# EAGLE design liot_esp8266_env (EAGLE 7.4.0)
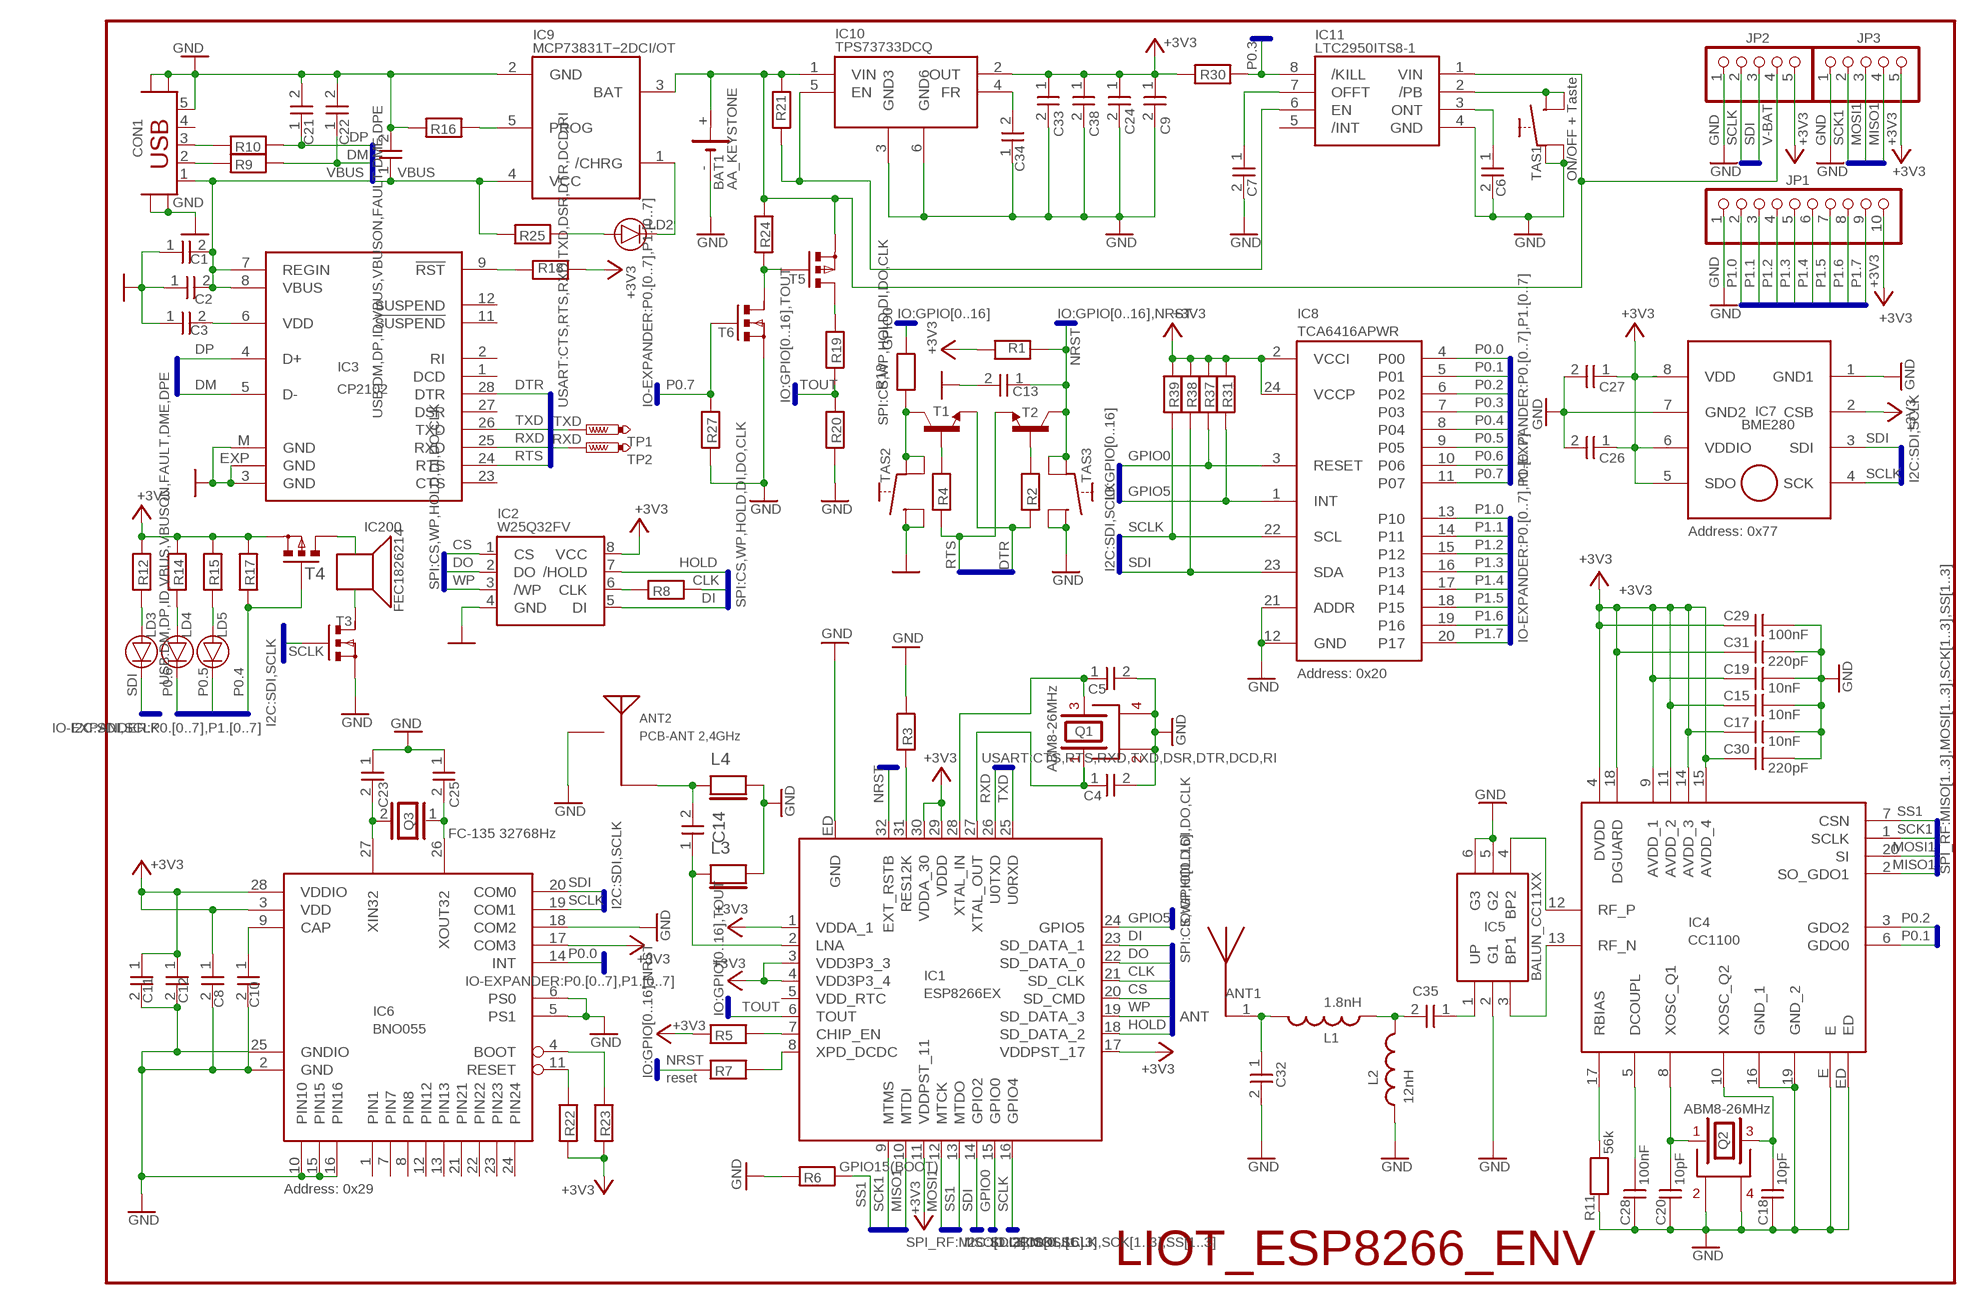
[diagram p0: schematic, sheet 1]

## Parts
ANT1  ANT_868MHZ  [ANT_868MHZ]
ANT2  PCB-ANT 2,4GHz  2.4GHZ_PCB  [2.4GHZ_PCB]
BAT1  AA_KEYSTONE  [AA_KEYSTONE]
C1  1U-16VX7R_0805  [C0805]
C2  1U-16VX7R_0805  [C0805]
C3  1U-16VX7R_0805  [C0805]
C4  10P-50VCOG_0603  [C0603]
C5  10P-50VCOG_0603  [C0603]
C6  100N-50VX7R_0603  [C0603]
C7  330N-16VX7R_0603  [C0603]
C8  100N-50VX7R_0603  [C0603]
C9  XX-XX-X7R_1210  [C1210]
C10  100N-50VX7R_0603  [C0603]
C11  6N8-50VX7R_0603  [C0603]
C12  100N-50VX7R_0603  [C0603]
C13  470P-50VX7R_0603  [C0603]
C14  5.6pF  CC0402  [C0402]
C15  10nF  CAPNP-2,5  [C0603]
C16  XX-XX-X7R_0805  [C0805]
C17  10nF  CAPNP-2,5  [C0603]
C18  10pF  CAPNP-2,5  [C0603]
C19  10nF  CAPNP-2,5  [C0603]
C20  10pF  CAPNP-2,5  [C0603]
C21  47P-50VCOG_0603  [C0603]
C22  47P-50VCOG_0603  [C0603]
C23  22P-50VNP0_0603  [C0603]
C24  100N-50VX7R_0603  [C0603]
C25  22P-50VNP0_0603  [C0603]
C26  100N-50VX7R_0603  [C0603]
C27  100N-50VX7R_0603  [C0603]
C28  100nF  CAPNP-2,5  [C0603]
C29  100nF  CAPNP-2,5  [C0603]
C30  220pF  CAPNP-2,5  [C0603]
C31  220pF  CAPNP-2,5  [C0603]
C32  10P-50VCOG_0603  [C0603]
C33  XX-XX-NB-X7R_1210  [C1210]
C34  XX-XX-X7R_0805  [C0805]
C35  100P-50VCOG_0603  [C0603]
C38  XX-XX-NB-X7R_1210  [C1210]
CON1  MICRO-USB-A/B  [MICRO_USB_A/B]
IC1  ESP8266EX  [ESP8266EX]
IC2  W25Q32FV  [SOIC-8_208MIL]
IC3  CP2102  [MLP28]
IC4  CC1100  [QLP20E-1+]
IC5  BALUN_CC11XX  [BALUN_CC11XX]
IC6  BNO055  [BNO055]
IC7  BME280  [BME280]
IC8  TCA6416APWR  [TSSOP24]
IC9  MCP73831T−2DCI/OT  LTC4054  [TSOT-23]
IC10  TPS73733DCQ  TPS73733DQC  [SOT223-6]
IC11  LTC2950ITS8-1  LTC2950  [TS8]
IC200  FEC1826214  BEEPER5X5  [BEEPER5X5]
JP1  PINHD-1X10  [1X10]
JP2  PINHD-1X5  [1X05]
JP3  PINHD-1X5  [1X05]
L1  1.8nH  L0603  [0603]
L2  12nH  L0603  [0603]
L3  NC  LL0402  [L0402]
L4  NC  LL0402  [L0402]
LD2  XXX_0603_H04  [LD0603_H04]
LD3  XXX_0603_H04  [LD0603_H04]
LD4  XXX_0603_H04  [LD0603_H04]
LD5  XXX_0603_H04  [LD0603_H04]
MA_BS1  MA_BS_L  [MARK_L]
MA_BS2  MA_BS_L  [MARK_L]
MA_LS1  MA_LS_L  [MARK_L]
MA_LS2  MA_LS_L  [MARK_L]
Q1  ABM8-26MHz  ABM8G  [ABM8G]
Q2  ABM8-26MHz  ABM8G  [ABM8G]
Q3  FC-135 32768Hz  FC-135  [FC-135]
R1  12K-1%_0603  [R0603]
R2  12K-1%_0603  [R0603]
R3  12K-1%_0603  [R0603]
R4  12K-1%_0603  [R0603]
R5  12K-1%_0603  [R0603]
R6  12K-1%_0603  [R0603]
R7  0R-1%_0603  [R0603]
R8  200R-1%_0603  [R0603]
R9  22R-1%_0603  [R0603]
R10  22R-1%_0603  [R0603]
R11  56k  RESEU-S2,5  [R0603]
R12  1K-1%_0603  [R0603]
R13  220R-1%_0603  [R0603]
R14  1K-1%_0603  [R0603]
R15  1K-1%_0603  [R0603]
R16  2K-1%_0603  [R0603]
R17  1K-1%_0603  [R0603]
R18  10K-1%_0603  [R0603]
R19  390K-1%_0603  [R0603]
R20  100K-1%_0603  [R0603]
R21  100K-1%_0603  [R0603]
R22  10K-1%_0603  [R0603]
R23  10K-1%_0603  [R0603]
R24  10K-1%_0603  [R0603]
R25  680R-1%_0603  [R0603]
R27  10K-1%_0603  [R0603]
R30  100K-1%_0603  [R0603]
R31  10K-1%_0603  [R0603]
R37  10K-1%_0603  [R0603]
R38  10K-1%_0603  [R0603]
R39  10K-1%_0603  [R0603]
T1  BC817-NPN-SOT23-BEC  [SOT23-BEC]
T2  BC817-NPN-SOT23-BEC  [SOT23-BEC]
T3  IRLML2402  [SOT23S23]
T4  IRLML6402  [SOT23S23]
T5  IRLML6402  [SOT23S23]
T6  IRLML2402  [SOT23S23]
TAS1  434333045822  [TAWU1_S_H18]
TAS2  434333045822  [TAWU1_S_H18]
TAS3  434333045822  [TAWU1_S_H18]
TP1  PTR1B1,27  [B1,27]
TP2  PTR1B1,27  [B1,27]

## Nets
+3V3: C8.1(C) C9.1(C) C11.1(C) C12.1(C) C15.1 C17.1 C19.1 C24.1(C) C26.1(C) C27.1(C) C29.1 C30.1 C31.1 C33.1(C) C38.1(C) IC1.1(VDDA_1) IC1.3(VDD3P3_3) IC1.4(VDD3P3_4) IC1.11(VDDPST_11) IC1.17(VDDPST_17) IC1.29(VDDD) IC1.30(VDDA_30) IC2.8(VCC) IC4.4(DVDD) IC4.9(AVDD_1) IC4.11(AVDD_2) IC4.14(AVDD_3) IC4.15(AVDD_4) IC4.18(DGUARD) IC6.3(VDD) IC6.17(COM3) IC6.28(VDDIO) IC7.2(CSB) IC7.5(SDO) IC7.6(VDDIO) IC7.8(VDD) IC8.2(VCCI) IC8.24(VCCP) IC10.2(OUT) JP1.10 JP2.5 JP3.5 R1.2(R) R5.1(R) R12.2(R) R14.2(R) R15.2(R) R17.2(R) R18.1(R) R22.1(R) R23.1(R) R30.2(R) R31.2(R) R37.2(R) R38.2(R) R39.2(R) T4.2(S)
/PB: IC11.2(/PB) TAS1.2(ON) TAS1.4(ON1)
CLK: IC1.21(SD_CLK) R8.2(R)
CS: IC1.20(SD_CMD) IC2.1(CS)
DI: IC1.23(SD_DATA_1) IC2.5(DI)
DM: C22.1(C) IC3.5(D-) R9.1(R)
DME: CON1.2(D-) R9.2(R)
DO: IC1.22(SD_DATA_0) IC2.2(DO)
DP: C21.1(C) IC3.4(D+) R10.1(R)
DPE: CON1.3(D+) R10.2(R)
DTR: IC3.28(DTR) R2.1(R) T1.E
GND: ANT2.GND BAT1.- C1.1(C) C2.1(C) C3.1(C) C4.2(C) C5.2(C) C6.2(C) C7.2(C) C8.2(C) C9.2(C) C10.2(C) C11.2(C) C12.2(C) C13.2(C) C15.2 C16.2(C) C17.2 C18.1 C19.2 C20.1 C21.2(C) C22.2(C) C23.1(C) C24.2(C) C25.1(C) C26.2(C) C27.2(C) C28.1 C29.2 C30.2 C31.2 C32.2(C) C33.2(C) C34.1(C) C38.2(C) CON1.5(GND) CON1.S1(GND) CON1.S2(GND) CON1.S3(GND) CON1.S4(GND) CON1.S5(GND) CON1.S6(GND) CON1.S7(GND) CON1.S8(GND) CON1.S9(GND) CON1.S10(GND) CON1.S11(GND) CON1.S12(GND) IC1.ED(GND) IC2.4(GND) IC3.3(GND) IC3.EXP(GND) IC3.M(GND) IC4.16(GND_1) IC4.19(GND_2) IC4.E IC4.ED IC5.2(G1) IC5.5(G2) IC5.6(G3) IC6.2(GND) IC6.5(PS1) IC6.6(PS0) IC6.10(PIN10) IC6.15(PIN15) IC6.16(PIN16) IC6.18(COM2) IC6.25(GNDIO) IC7.1(GND1) IC7.7(GND2) IC8.12(GND) IC8.21(ADDR) IC9.2(GND) IC10.3(GND3) IC10.6(GND6) IC11.4(GND) JP1.1 JP2.1 JP3.1 L2.1 L3.2(L) L4.2(L) Q1.2 Q1.4 Q2.2 Q2.4 R3.2(R) R6.1(R) R11.1 R16.1(R) R20.2(R) R27.1(R) T3.2(S) T6.2(S) TAS1.1(COMM) TAS1.3(COMM1) TAS2.2(ON) TAS2.4(ON1) TAS3.2(ON) TAS3.4(ON1)
GPIO0: IC1.15(GPIO0) IC8.3(RESET) R13.2(R) R37.1(R)
GPIO5: IC1.24(GPIO5) IC8.1(INT) R31.1(R)
HOLD: IC1.18(SD_DATA_2) IC2.7(/HOLD)
IC12: IC200.- T3.3(D)
MISO1: IC1.10(MTDI) IC4.2(SO_GDO1) JP3.4
MOSI1: IC1.12(MTCK) IC4.20(SI) JP3.3
N$1: C4.1(C) IC1.27(XTAL_OUT) Q1.1
N$2: R2.2(R) T2.B
N$3: C3.2(C) IC3.6(VDD)
N$4: IC1.7(CHIP_EN) R5.2(R)
N$5: R4.2(R) T1.B
N$6: IC1.31(RES12K) R3.1(R)
N$7: IC1.8(XPD_DCDC) R7.1(R)
N$8: IC2.6(CLK) R8.1(R)
N$10: C14.1(C) IC1.2(LNA) L3.1(L)
N$11: C18.2 IC4.10(XOSC_Q2) Q2.3
N$12: C20.2 IC4.8(XOSC_Q1) Q2.1
N$13: IC4.17(RBIAS) R11.2
N$14: C28.2 IC4.5(DCOUPL)
N$15: C5.1(C) IC1.28(XTAL_IN) Q1.3
N$16: IC9.5(PROG) R16.2(R)
N$17: IC9.1(/CHRG) LD2.2(K)
N$18: IC4.13(RF_N) IC5.3(BP1)
N$19: IC4.12(RF_P) IC5.4(BP2)
N$20: ANT1.1(ANT) C32.1(C) L1.2
N$21: LD2.1(A) R25.1(R)
N$22: C35.2(C) L1.1 L2.2
N$23: C35.1(C) IC5.1(UP)
N$24: ANT2.ANT C14.2(C) L4.1(L)
N$25: IC6.11(RESET) R22.2(R)
N$26: IC6.4(BOOT) R23.2(R)
N$27: C10.1(C) IC6.9(CAP)
N$28: C23.2(C) IC6.27(XIN32) Q3.2
N$29: IC10.5(EN) IC11.6(EN) R21.1(R)
N$30: C25.2(C) IC6.26(XOUT32) Q3.1
N$32: R13.1(R) T1.C TAS2.1(COMM) TAS2.3(COMM1)
N$33: C34.2(C) IC10.4(FR)
N$34: IC200.+ T4.3(D)
N$35: LD3.1(A) R12.1(R)
N$36: LD4.1(A) R14.1(R)
N$37: IC3.9(!RST) R18.2(R)
N$38: LD5.1(A) R15.1(R)
N$39: R19.2(R) T5.3(D)
N$40: R24.1(R) T5.1(G) T6.3(D)
N$58: C7.1(C) IC11.7(OFFT)
N$59: C6.1(C) IC11.3(ONT)
NRST: C13.1(C) IC1.32(EXT_RSTB) R1.1(R) R7.2(R) T2.C TAS3.1(COMM) TAS3.3(COMM1)
P0.0: IC6.14(INT) IC8.4(P00)
P0.1: IC4.6(GDO0) IC8.5(P01)
P0.2: IC4.3(GDO2) IC8.6(P02)
P0.3: IC8.7(P03) IC11.8(/KILL) R30.1(R)
P0.4: IC8.8(P04) R17.1(R) T4.1(G)
P0.5: IC8.9(P05) LD5.2(K)
P0.6: IC8.10(P06) LD4.2(K)
P0.7: IC8.11(P07) R27.2(R) T6.1(G)
P1.0: IC8.13(P10) JP1.2
P1.1: IC8.14(P11) JP1.3
P1.2: IC8.15(P12) JP1.4
P1.3: IC8.16(P13) JP1.5
P1.4: IC8.17(P14) JP1.6
P1.5: IC8.18(P15) JP1.7
P1.6: IC8.19(P16) JP1.8
P1.7: IC8.20(P17) JP1.9
RTS: IC3.24(RTS) R4.1(R) T2.E
RXD: IC1.26(U0TXD) IC3.25(RXD) TP2.PP(TP)
SCK1: IC1.9(MTMS) IC4.1(SCLK) JP3.2
SCLK: IC1.16(GPIO4) IC6.19(COM1) IC7.4(SCK) IC8.22(SCL) JP2.2 R39.1(R) T3.1(G)
SDI: IC1.14(GPIO2) IC6.20(COM0) IC7.3(SDI) IC8.23(SDA) JP2.3 LD3.2(K) R38.1(R)
SS1: IC1.13(MTDO) IC4.7(CSN) R6.2(R)
TOUT: IC1.6(TOUT) R19.1(R) R20.1(R)
TXD: IC1.25(U0RXD) IC3.26(TXD) TP1.PP(TP)
V-BAT: BAT1.+ IC9.3(BAT) IC10.1(VIN) IC11.1(VIN) JP2.4 R21.2(R) R24.2(R) T5.2(S)
VBUS: C1.2(C) C2.2(C) C16.1(C) CON1.1(VBUS) IC3.7(REGIN) IC3.8(VBUS) IC9.4(VCC) R25.2(R)
WP: IC1.19(SD_DATA_3) IC2.3(/WP)
Unconnected: CON1.4(ID) IC1.5(VDD_RTC) IC3.1(DCD) IC3.2(RI) IC3.11(!SUSPEND) IC3.12(SUSPEND) IC3.23(CTS) IC3.27(DSR) IC6.1(PIN1) IC6.7(PIN7) IC6.8(PIN8) IC6.12(PIN12) IC6.13(PIN13) IC6.21(PIN21) IC6.22(PIN22) IC6.23(PIN23) IC6.24(PIN24) IC11.5(/INT) IC200.NC MA_BS1.1(MARK) MA_BS2.1(MARK) MA_LS1.1(MARK) MA_LS2.1(MARK)

## Buses
USB:DM,DP,ID,VBUS,VBUSON,FAULT,DME,DPE
USART:CTS,RTS,RXD,TXD,DSR,DTR,DCD,RI
SPI:CS,WP,HOLD,DI,DO,CLK
I2C:SDI,SCLK
IO-EXPANDER:P0.[0..7],P1.[0..7]
IO:GPIO[0..16]
IO:GPIO[0..16],NRST
SPI_RF:MISO[1..3],MOSI[1..3],SCK[1..3],SS[1..3]
IO:GPIO[0..16],TOUT

## Notes on the sheet
- ON/OFF + Taste
- Address: 0x77
- Address: 0x20
- reset
- GPIO15(BOOT)
- Address: 0x29
- LIOT_ESP8266_ENV

## Library data of the parts
ANT1 = Liers_RF:ANT_868MHZ
ANT2 = Liers_RF:2.4GHZ_PCB
BAT1 = RADIO:AA_KEYSTONE
C1-C3 C6-C13 C16 C24 C26 C27 C33 C34 C38 = kke:*X7R?: Kerko XXXX7R
C4 C5 C21 C22 C32 C35 = kke:*COG?: KEMET Kerko Keramik COG -55.+125C
C14 = RADIO:C
C15 C17-C20 C28-C31 = DISCRETE:CAPNP-2,5
C23 C25 = kke:*NP0?: NICHT-EINSETZEN-KEMET Kerko Keramik NP0 -55.+125C
CON1 = Liers_RF:MICRO-USB-A/B
IC1 = LIOT:ESP8266EX
IC2 = Liers_WiFi:W25Q32FV
IC3 = silabs:CP210*: Single-Chip USB to UART Bridge Source: www.silabs.com .. CP2101.pdf / cp2102.pdf
IC4 = RADIO:CC1100
IC5 = CC430:BALUN_CC11XX
IC6 = Liers_RF:BNO055
IC7 = Liers_RF:BME280
IC8 = Liers_RF:TCA6416APWR
IC9 = RADIO:LTC4054
IC10 = Liers_RF:TPS73733DQC
IC11 = Liers_RF:LTC2950
IC200 = Liers_Extra:BEEPER5X5
JP1 = PINHEAD_old:PINHD-1X10
JP2 JP3 = PINHEAD_old:PINHD-1X5
L1 L2 = Liers_SMD:L0603
L3 L4 = RADIO:L
LD2-LD5 = Liers_WiFi:*?: DIVERSE LED 2mA / 20mA; ARTNR1: SHP-98903-000
MA_BS1 MA_BS2 = xko:MA_BS: Marke für SMD-Automat bauteileseitig; ARTNR1: XKO-99997-000
MA_LS1 MA_LS2 = xko:MA_LS: Marke für SMD-Automat lötseitig; ARTNR1: XKO-99997-000
Q1 Q2 = RADIO:ABM8G
Q3 = RADIO:FC-135
R1-R10 R12-R25 R27 R30 R31 R37-R39 = wdm:*-1%?: DIVERSE Widerstand Metallfilm 1%
R11 = DISCRETE:RESEU-S2,5
T1 T2 = transistor:*-NPN-: NPN Transistror
T3 T6 = LIERS_wireless:IRLML2402
T4 T5 = LIERS_wireless:IRLML6402
TAS1-TAS3 = liers:434333045822?: WUERTH SMD Taste seitliche Betätigung 434333045822 12V 50mA 100mR; ARTNR1: TAS-99953-000
TP1 TP2 = testpad:PTR1: TEST PIN

## Board
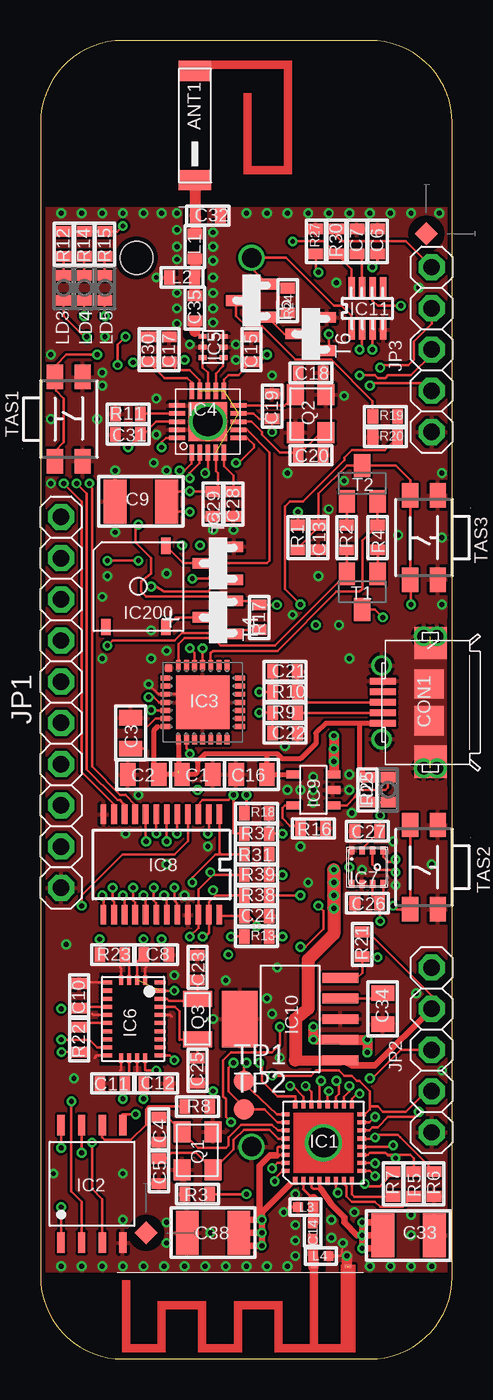
[diagram p1: board, top side]
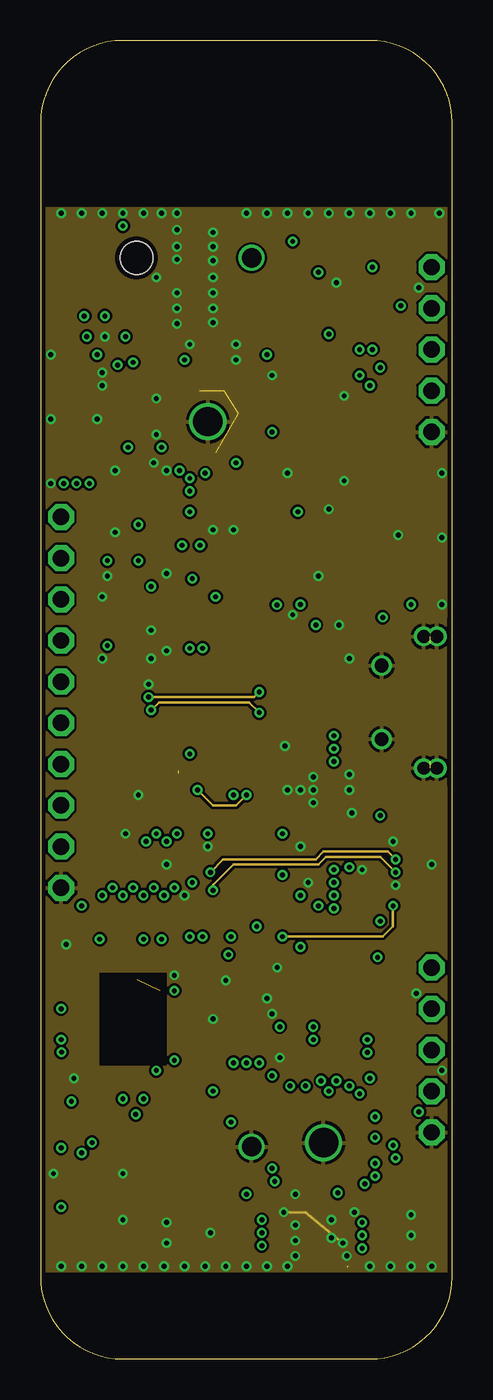
[diagram p2: board, inner layer Route2]
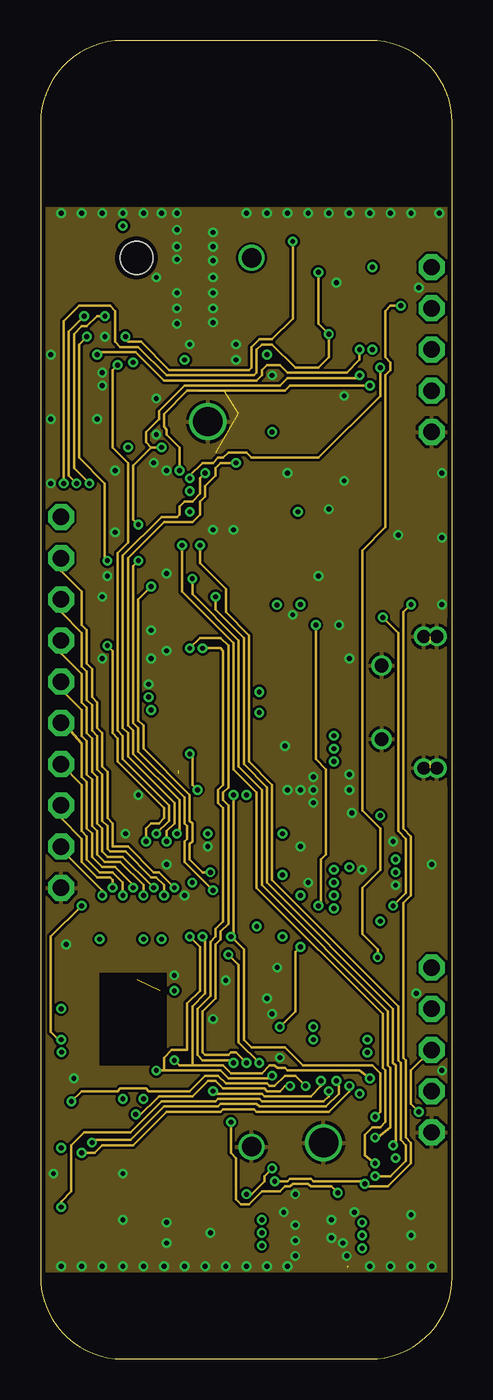
[diagram p3: board, inner layer Route15]
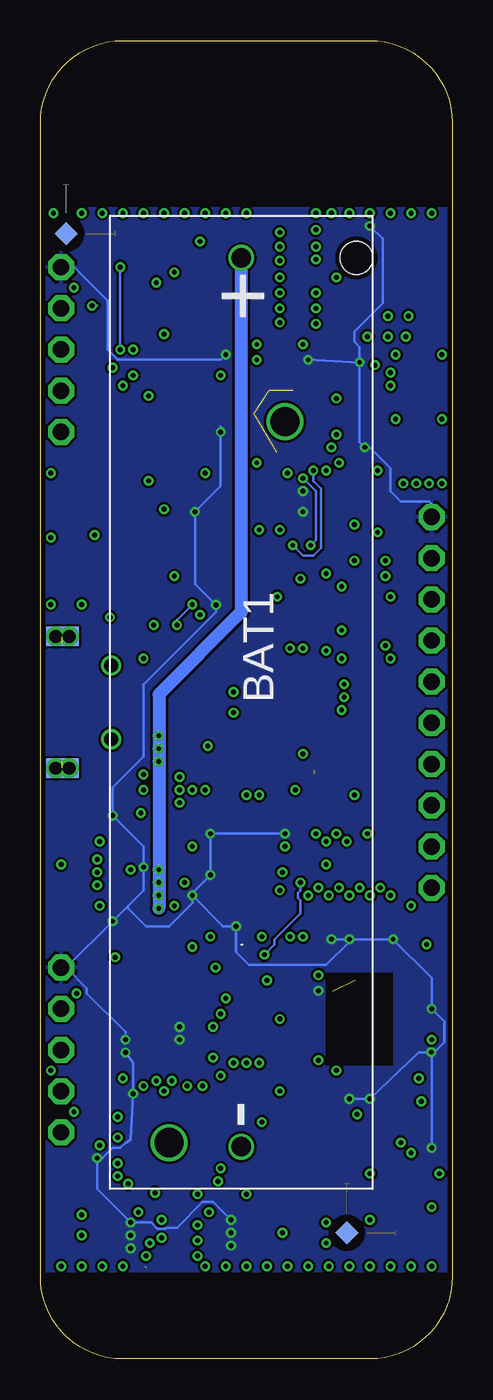
[diagram p4: board, bottom side, seen from below]

Size 25.4 x 81.28 mm. Coordinates in mm from the lower left corner, seen from the top.
Outline: 0,5.08 arc90 5.08,0 20.32,0 arc90 25.4,5.08 25.4,76.2 arc90 20.32,81.28 5.08,81.28 arc90 0,76.2 0,5.08
Copper layers (1+2*15+16): Top 0.035mm / dielectric 0.38mm / Route2 0.035mm / dielectric 0.71mm / Route15 0.035mm / dielectric 0.38mm / Bottom 0.035mm
Design rules "PCB-POOL Standard_ML4 *": minimum track width 0.15mm, minimum drill 0.3mm, track to track 0.15mm, track to pad 0.15mm, pad to pad 0.15mm, via to via 0.15mm, smd to smd 0.15mm, copper to edge 0.3mm, drill to drill 0.2mm, minimum pad ring 0.2mm, minimum via ring 0.15mm, stop-mask expansion 0.075mm, vias tented up to drill 0mil, thermal gap 0.2mm
tRestrict: 8 lines

### Footprints (pad centres in the part's own frame; a part is rotated, then mirrored left to right if it is on the bottom)
ANT_868MHZ = smd 2 x 1.25: 1 0,-3.37; 2 0,3.37
2.4GHZ_PCB = smd 0.406 x 0.203: ANT 3.05,-0.4; GND 0.95,-0.4
AA_KEYSTONE = drill 1.2: + 27.4,0; - -27.4,0 | hole 2: 27.4,-7.1
C0805 = smd 0.95 x 1.4: 1 -0.953,0; 2 0.953,0
C0603 = smd 0.65 x 0.9: 1 -0.769,0; 2 0.769,0
C1210 = smd 1.4 x 2.7: 1 -1.587,0; 2 1.587,0
C0402 = smd 0.6 x 0.6: 1 -0.476,0; 2 0.476,0
MICRO_USB_A/B = smd 1.6 x 0.4: 1 3.006,1.3; 2 3.006,0.65; 3 3.006,0; 4 3.006,-0.65; 5 3.006,-1.3 | drill 0.8 pad 1.2: S1 0.487,4.062; S2 -0.325,4.062; S8 -0.325,-4.062; S9 0.487,-4.062 | smd 2 x 1.2 bottom: S3 0.081,4.062; S10 0.081,-4.062 | smd 2 x 2: S4 0.081,3.656; S7 0.081,-3.656 | smd 1.8 x 1.8: S5 0.163,1.137; S6 0.163,-1.137 | drill 0.85 pad 1.2: S11 3.087,-2.275; S12 3.087,2.275
ESP8266EX = smd 0.5 x 0.25: 1 -2.35,1.75; 2 -2.35,1.25; 3 -2.35,0.75; 4 -2.35,0.25; 5 -2.35,-0.25; 6 -2.35,-0.75; 7 -2.35,-1.25; 8 -2.35,-1.75; 17 2.35,-1.75; 18 2.35,-1.25; 19 2.35,-0.75; 20 2.35,-0.25; 21 2.35,0.25; 22 2.35,0.75; 23 2.35,1.25; 24 2.35,1.75 | smd 0.25 x 0.5: 9 -1.75,-2.35; 10 -1.25,-2.35; 11 -0.75,-2.35; 12 -0.25,-2.35; 13 0.25,-2.35; 14 0.75,-2.35; 15 1.25,-2.35; 16 1.75,-2.35; 25 1.75,2.35; 26 1.25,2.35; 27 0.75,2.35; 28 0.25,2.35; 29 -0.25,2.35; 30 -0.75,2.35; 31 -1.25,2.35; 32 -1.75,2.35 | drill 1.8 pad 2.286: ED 0,0
SOIC-8_208MIL = smd 0.457 x 1.27: 1 -1.905,-3.619; 2 -0.635,-3.619; 3 0.635,-3.619; 4 1.905,-3.619; 5 1.905,3.619; 6 0.635,3.619; 7 -0.635,3.619; 8 -1.905,3.619
MLP28 = smd 0.6 x 0.3: 1 -2.3,1.5; 2 -2.3,1; 3 -2.3,0.5; 4 -2.3,0; 5 -2.3,-0.5; 6 -2.3,-1; 7 -2.3,-1.5; 15 2.3,-1.5; 16 2.3,-1; 17 2.3,-0.5; 18 2.3,0; 19 2.3,0.5; 20 2.3,1; 21 2.3,1.5 | smd 0.3 x 0.6: 8 -1.5,-2.3; 9 -1,-2.3; 10 -0.5,-2.3; 11 0,-2.3; 12 0.5,-2.3; 13 1,-2.3; 14 1.5,-2.3; 22 1.5,2.3; 23 1,2.3; 24 0.5,2.3; 25 0,2.3; 26 -0.5,2.3; 27 -1,2.3; 28 -1.5,2.3 | smd 3.3 x 3.3: EXP 0,0 | smd 0.435 x 0.435: M -2.103,2.103
QLP20E-1+ = smd 0.28 x 1: 1 -1,-1.9; 2 -0.5,-1.9; 3 0,-1.9; 4 0.5,-1.9; 5 1,-1.9; 11 1,1.9; 12 0.5,1.9; 13 0,1.9; 14 -0.5,1.9; 15 -1,1.9 | smd 1 x 0.28: 6 1.9,-1; 7 1.9,-0.5; 8 1.9,0; 9 1.9,0.5; 10 1.9,1; 16 -1.9,1; 17 -1.9,0.5; 18 -1.9,0; 19 -1.9,-0.5; 20 -1.9,-1 | smd 2.4 x 2.4: E 0,0 | drill 1.8 pad 2.286: ED 0,0
BALUN_CC11XX = smd 0.3 x 0.5: 1 0.65,0.651; 2 0,0.65; 3 -0.65,0.65; 4 -0.651,-0.651; 5 0,-0.652; 6 0.65,-0.651
BNO055 = smd 0.25 x 0.675: 1 -2.25,1.65; 6 -2.25,-1.65; 7 -1.75,-1.65; 8 -1.25,-1.65; 9 -0.75,-1.65; 10 -0.25,-1.65; 11 0.25,-1.65; 12 0.75,-1.65; 13 1.25,-1.65; 14 1.75,-1.65; 15 2.25,-1.65; 20 2.25,1.65; 21 1.75,1.65; 22 1.25,1.65; 23 0.75,1.65; 24 0.25,1.65; 25 -0.25,1.65; 26 -0.75,1.65; 27 -1.25,1.65; 28 -1.75,1.65 | smd 0.575 x 0.25: 2 -2.4,0.75; 3 -2.4,0.25; 4 -2.4,-0.25; 5 -2.4,-0.75; 16 2.4,-0.75; 17 2.4,-0.25; 18 2.4,0.25; 19 2.4,0.75
BME280 = smd 0.35 x 0.5: 1 0.975,-1.025; 2 0.325,-1.025; 3 -0.325,-1.025; 4 -0.975,-1.025; 5 -0.975,1.025; 6 -0.325,1.025; 7 0.325,1.025; 8 0.975,1.025
TSSOP24 = smd 0.35 x 1.2: 1 -3.575,-3.099; 2 -2.925,-3.099; 3 -2.275,-3.099; 4 -1.625,-3.099; 5 -0.975,-3.099; 6 -0.325,-3.099; 7 0.325,-3.099; 8 0.975,-3.099; 9 1.625,-3.099; 10 2.275,-3.099; 11 2.925,-3.099; 12 3.575,-3.099; 13 3.575,3.099; 14 2.925,3.099; 15 2.275,3.099; 16 1.625,3.099; 17 0.975,3.099; 18 0.325,3.099; 19 -0.325,3.099; 20 -0.975,3.099; 21 -1.625,3.099; 22 -2.275,3.099; 23 -2.925,3.099; 24 -3.575,3.099
TSOT-23 = smd 0.5 x 0.9: 1 -0.95,-1.216; 2 0,-1.216; 3 0.95,-1.216; 4 0.95,1.216; 5 -0.95,1.216
SOT223-6 = smd 0.6 x 2.2: 1 -2.54,-3.1; 2 -1.27,-3.1; 3 0,-3.1; 4 1.27,-3.1; 5 2.54,-3.1 | smd 3.5 x 2.2: 6 0,3.1
TS8 = smd 0.4 x 1.27: 1 -0.975,-1.3; 2 -0.325,-1.3; 3 0.325,-1.3; 4 0.975,-1.3; 5 0.975,1.3; 6 0.325,1.3; 7 -0.325,1.3; 8 -0.975,1.3
BEEPER5X5 = smd 1 x 0.6: + -2.5,-1.7; - 2.5,-1.7; NC -2.5,2
1X10 = drill 1.016 pad 1.6 octagon: 1 -11.43,0; 2 -8.89,0; 3 -6.35,0; 4 -3.81,0; 5 -1.27,0; 6 1.27,0; 7 3.81,0; 8 6.35,0; 9 8.89,0; 10 11.43,0
1X05 = drill 1.016 pad 1.6 octagon: 1 -5.08,0; 2 -2.54,0; 3 0,0; 4 2.54,0; 5 5.08,0
0603 = smd 0.65 x 0.9: 1 -0.769,0; 2 0.769,0
L0402 = smd 0.6 x 0.6: 1 -0.476,0; 2 0.476,0
LD0603_H04 = smd 0.65 x 0.9: 1 0.769,0; 2 -0.769,0
MARK_L = smd 1 x 1 rotated 45: 1 0,0
ABM8G = smd 1.3 x 1.05: 1 -1.15,-0.95; 2 1.2,-0.95; 3 1.2,0.95; 4 -1.15,0.95
FC-135 = smd 1 x 1.8: 1 -1.25,0; 2 1.25,0
R0603 = smd 0.65 x 0.9: 1 -0.769,0; 2 0.769,0
SOT23-BEC = smd 1 x 1.4: B -0.95,-1.1; C 0,1.1; E 0.95,-1.1
SOT23S23 = smd 1.1 x 0.65: 1 0.986,-1.018; 2 0.991,1.017; 3 -1.016,0
TAWU1_S_H18 = smd 1 x 1.5: 1 0.85,-2.6; 2 -0.85,-2.6; 3 0.85,2.6; 4 -0.85,2.6
B1,27 = smd 1.27 x 1.27: PP 0,0

### Placement (x,y rotation side)
ANT1  9.53,76.04 0 top
ANT2  19.92,5.32 180 top
BAT1  13.02,40.48 90 bottom
C1  9.68,36.04 180 top
C2  6.35,36.04 0 top
C3  5.56,38.58 270 top
C4  7.3,14.13 270 top
C5  7.3,11.59 270 top
C6  20.8,68.9 90 top
C7  19.53,68.9 90 top
C8  7.14,24.92 0 top
C9  6.19,52.86 180 top
C10  2.38,22.38 90 top
C11  4.45,16.99 180 top
C12  7.14,16.99 0 top
C13  17.14,50.64 270 top
C14  16.79,7.89 270 top
C15  13.02,62.23 90 top
C16  13.02,36.04 180 top
C17  7.94,62.23 90 top
C18  16.67,60.8 180 top
C19  14.29,58.74 90 top
C20  16.67,55.72 180 top
C21  15.08,42.39 0 top
C22  15.08,38.58 0 top
C23  9.68,24.13 270 top
C24  13.34,27.3 0 top
C25  9.68,17.78 90 top
C26  20.16,28.1 180 top
C27  20.16,32.54 180 top
C28  11.91,52.7 90 top
C29  10.64,52.7 270 top
C30  6.67,62.23 90 top
C31  5.4,56.99 180 top
C32  10.32,70.48 0 top
C33  22.7,7.62 0 top
C34  21.11,21.59 90 top
C35  9.53,64.77 90 top
C38  10.64,7.78 180 top
CON1  24.13,40.48 180 top
IC1  17.46,13.34 90 top
IC2  3.17,10.79 0 top
IC3  10,40.48 0 top
IC4  10.32,57.78 0 top
IC5  10.64,62.39 90 top
IC6  5.71,20.95 270 top
IC7  20.16,30.32 180 top
IC8  7.46,30.48 180 top
IC9  16.83,35.08 90 top
IC10  15.4,20.95 90 top
IC11  20.16,64.77 0 top
IC200  6.03,47.62 90 top
JP1  1.27,40.48 90 top
JP2  24.13,19.05 90 top
JP3  24.13,62.23 90 top
L1  9.53,68.58 90 top
L2  8.73,66.67 0 top
L3  16.35,9.37 180 top
L4  17.3,6.35 0 top
LD2  21.43,35.08 270 top
LD3  1.43,66.04 90 top
LD4  2.7,66.04 90 top
LD5  3.97,66.04 90 top
MA_BS1  6.51,7.78 0 top
MA_BS2  23.81,69.37 0 top
MA_LS1  6.51,7.78 0 bottom
MA_LS2  23.81,69.37 0 bottom
Q1  9.68,12.86 270 top
Q2  16.67,58.26 90 top
Q3  9.68,20.95 90 top
R1  15.88,50.64 90 top
R2  18.89,50.64 90 top
R3  9.68,10.16 180 top
R4  20.8,50.64 270 top
R5  23.02,10.79 270 top
R6  24.29,10.79 90 top
R7  21.75,10.79 90 top
R8  9.68,15.56 0 top
R9  15.08,39.85 0 top
R10  15.08,41.12 0 top
R11  5.4,58.26 0 top
R12  1.43,68.74 90 top
R13  13.34,26.04 180 top
R14  2.7,68.74 90 top
R15  3.97,68.74 90 top
R16  16.83,32.7 180 top
R17  13.49,45.72 90 top
R18  13.34,33.66 180 top
R19  21.27,58.1 180 top
R20  21.27,56.83 180 top
R21  19.84,25.56 90 top
R22  2.38,19.68 90 top
R23  4.45,24.92 0 top
R24  15.24,65.25 90 top
R25  20.16,35.08 90 top
R27  16.99,68.9 270 top
R30  18.26,68.9 90 top
R31  13.34,31.11 0 top
R37  13.34,32.38 0 top
R38  13.34,28.57 0 top
R39  13.34,29.84 0 top
T1  19.84,47.31 180 top
T2  19.84,53.98 0 top
T3  10.95,49.05 0 top
T4  10.95,45.72 0 top
T5  13.02,65.25 0 top
T6  16.67,63.18 0 top
TAS1  1.75,57.94 0 top
TAS2  23.65,30.32 180 top
TAS3  23.65,50.64 180 top
TP1  12.54,17.14 0 top
TP2  12.54,15.4 0 top

### Tracks (layer width: path | path; a pad name or v marks a point on that pad's centre or on a via)
+3V3  (via drill 0.3)  (4 unrouted)
  Top 0.15: R30.2 18.26,69.22 18.57,68.9 22.07,68.9 22.54,68.9 JP3.5 | R12.2 R14.2 R15.2 4.74,69.51 v5.08,69.85 | T4.2 13.25,46.74 R17.2 v14.58,46.49 | v6.35,25.88 6.38,25.74 C8.1 5.96,24.51 IC6.3 | IC8.24 | IC8.24 11.11,27.3 12.86,27.3 13.18,26.99 | 13.18,26.99 13.26,26.91 v13.34,26.67 13.34,26.83 13.18,26.99 | C24.1 11.11,27.3 IC8.24 | v14.92,29.84 R39.2 R31.2 | R38.2 v16.03,28.57 | v20.95,33.5 20.93,33.47 C27.1 19.84,31.45 IC7.2 | C29.1 9.23,53.47 v9.21,53.5 | v9.21,52.23 8.1,52.23 7.78,52.55 C9.1 7.78,53.5 7.8,53.47 C29.1 | IC4.4 10.82,54.74 10.95,54.61 10.95,53.79 C29.1 | IC4.9 13.15,58.28 13.49,57.94 14.26,57.94 | 14.26,57.94 C19.1 | IC4.11 11.32,60.37 11.59,60.64 12.2,60.64 C15.1 13.52,61.46 v13.97,61.91 | IC4.15 9.32,60.21 9.05,60.48 7.64,60.48 C30.1 5.85,61.46 v5.71,61.44 | IC4.14 9.82,60.35 9.21,60.96 8.44,60.96 | 8.44,60.96 C17.1 8.76,61.46 v8.89,61.59 8.73,61.44 7.94,61.44 8.41,60.96 8.44,60.96 | 6.19,56.99 C31.1 | IC4.18 7.14,57.78 6.35,56.99 6.19,56.99 | 6.19,56.99 v5.4,56.2 | 14.26,57.94 14.29,57.94 v14.29,57.15 | 13.49,8.73 v13.65,8.57 12.22,8.57 C38.1 12.22,8.41 12.38,8.57 | 21.27,12.7 21.43,12.59 21.91,12.59 | 21.91,12.59 22.82,12.59 23.02,12.38 R5.1 | IC1.3 16.71,10.59 16.83,10.48 17.3,10.48 17.21,10.39 IC1.4 | v5.08,16.03 5.21,16.06 C11.1 5.46,17.24 IC6.17 | IC2.8 v1.27,13.02 | IC1.29 14.67,13.09 14.61,13.02 14.61,12.58 | 14.61,12.58 14.59,12.56 | IC1.30 14.61,12.59 14.61,12.58 | IC8.2 10.39,32.45 v10.32,32.38 | IC1.17 19.21,16.04 19.53,16.35 v19.68,16.35 | 21.91,12.54 21.91,12.59 | IC1.11 20.2,12.59 20.32,12.7 21.27,12.7 | 21.27,12.7 21.43,12.54 21.91,12.54 | 21.91,12.54 v21.91,12.38
  Top 0.15: IC7.5 21.14,28.3 C26.1 | IC7.6 20.49,28.54 C26.1 | C26.1 20.93,27.01 v20.95,26.99 | 14.13,32.38 R37.2 R18.1 14.1,32.41 14.13,32.38 | IC7.8 19.19,30.18 v19.05,30.32 | 14.13,32.38 v14.92,32.38 | R1.2 v15.88,52.23 | R22.1 v1.29,18.92 | C12.1 6.38,16.06 v6.35,16.03 6.53,16.22 | IC1.1 15.71,10.95 15.56,10.79 15.39,10.64 15.4,10.64 13.65,8.89 | IC6.28 v8.25,22.7 v8.26,22.7 | R23.1 3.68,26.01 v3.65,25.88 3.68,25.85 R23.1
  Top 0.406: 14.59,12.56 14.15,12.56 13.49,11.91 13.49,8.73 | 15.32,10.72 13.65,9.05 13.65,8.89 v13.65,8.57 | 17.3,10.48 17.94,9.53 18.73,8.73 18.73,8.41 19.53,7.62 v19.84,7.62 | v19.84,7.62 C33.1 21.11,8.41 v19.84,8.41 v19.84,7.62 | 12.22,6.99 v13.65,6.99 v13.65,8.57 | v13.65,7.78 C38.1 | v13.65,8.57 12.38,8.57 | 21.11,6.83 v19.84,6.83 v19.84,7.62
  Top 0.61: v16.83,20.48 v16.83,19.68 IC10.2 v20.16,19.68 v20.16,18.89
  Bottom 0.15: 4.92,69.69 v5.08,69.85 4.29,69.06 4.29,65.09 6.03,63.34 6.03,62.71 5.71,62.39 v5.71,61.44 | JP1.10 1.27,52.7 1.43,52.86 3.17,52.86 3.81,53.5 3.81,54.93 5.08,56.2 v5.4,56.2 | v5.4,56.2 5.56,56.04 | 8.73,61.44 v8.89,61.59 v5.71,61.44 | 13.81,61.75 v13.97,61.91 14.29,61.59 20.64,61.59 21.27,62.23 21.27,65.25 23.34,67.31 JP3.5 | 14.29,57.47 v14.29,57.15 14.29,53.82 v15.88,52.23 15.88,47.78 v14.58,46.49 14.58,46.06 19.05,41.59 19.05,37.15 20.95,35.24 v20.95,33.5 19.05,31.59 v19.05,30.32 19.05,28.89 20,27.94 | v1.27,13.02 1.27,18.89 1.29,18.89 | v10.32,32.38 v14.92,32.38 v14.92,29.84 16.03,28.73 v16.03,28.57 | v20.16,18.89 19.68,18.26 v19.68,16.35 19.84,13.49 20.16,13.34 20.48,13.02 20.95,13.02 21.59,12.38 v21.91,12.38 21.91,10.48 v19.84,8.41 18.57,8.41 18.26,8.1 18.18,8.02 17.7,8.02 17.62,8.1 16.99,8.1 15.4,9.68 14.76,9.68 v13.65,8.57 | v20.16,19.68 20.16,20.16 22.54,22.54 22.54,22.86 23.81,24.13 | JP2.5 23.81,24.13 | 23.81,24.13 v20.95,26.99 20,27.94 | v16.03,28.57 16.03,28.1 17.46,26.67 18.89,26.67 20,27.78 20,27.94 | v16.03,28.57 14.13,26.67 v13.34,26.67 13.34,25.08 12.54,24.29 7.78,24.29 6.35,25.72 v6.35,25.88 | v5.71,61.44 5.71,56.52 v5.4,56.2 | v6.35,25.88 v3.65,25.88 1.27,23.5 v1.27,21.59 0.48,20.8 0.48,19.53 1.09,18.92 v1.29,18.92 1.29,18.89 | 1.29,18.89 2.06,18.89 v5.08,16.03 v6.35,16.03 | v7.46,25.88 v6.35,25.88
  pour Bottom: 0,70.96 25.4,70.96 25.4,65.41 26.67,65.41 26.67,64.14 25.4,64.14 25.4,5.4 0,5.4
/PB  (via drill 0.3)
  Top 0.15: TAS1.2 0.9,55.98 1.43,56.52 1.43,59.21 0.95,59.69 0.95,60.49 TAS1.4 0.95,60.6 0.95,61.28 1.59,61.91 v3.49,61.91 | IC11.2 19.84,62.38 v19.68,62.23
  Route15 0.15: v19.68,62.23 19.68,61.59 18.89,60.8 15.24,60.8 14.76,61.28 13.97,61.28 13.65,60.96 13.65,60.64 13.34,60.33 7.62,60.33 5.87,62.07 3.65,62.07 v3.49,61.91
CLK  (via drill 0.3)
  Top 0.15: IC1.21 17.21,17.05 v17.3,17.14 | v10.64,16.51 10.64,15.58 R8.2
  Route15 0.15: v17.3,17.14 17.3,16.83 16.67,16.19 13.81,16.19 13.65,16.35 10.95,16.35 10.79,16.35 v10.64,16.51
CS  (via drill 0.3)
  Top 0.15: IC1.20 17.71,16.44 v17.78,16.51 | IC2.1 v1.27,9.37
  Route15 0.15: v17.78,16.51 17.78,16.19 17.46,15.88 13.65,15.88 13.49,16.03 10.95,16.03 10.79,15.88 7.46,15.88 5.56,13.97 2.7,13.97 1.91,13.18 1.91,10.32 1.27,9.68 v1.27,9.37
DI  (via drill 0.3)
  Top 0.15: IC1.23 16.21,16.17 15.56,16.83 v15.4,16.83 | v5.87,15.08 5.08,15.08 IC2.5
  Route15 0.15: v15.4,16.83 15.24,16.99 14.76,16.51 13.97,16.51 13.81,16.67 11.27,16.67 10.79,17.14 10.32,17.14 9.37,16.19 7.3,16.19 6.03,14.92 v5.87,15.08
DM  (via drill 0.3)
  Top 0.15: C22.1 R9.1 v13.49,39.85 | IC3.5 6.85,39.98 v6.83,40.01
  Route2 0.15: v6.83,40.01 7.3,40.48 12.86,40.48 v13.49,39.85
DME
  Top 0.15: CON1.2 15.87,39.83 R9.2
DO  (via drill 0.3)
  Top 0.15: IC1.22 16.71,16.47 v16.35,16.83 | IC2.2 2.54,9.68 1.91,10.32 v1.91,15.88
  Route15 0.15: v16.35,16.83 15.72,17.46 15.08,17.46 14.45,16.83 14.13,16.83 13.97,16.99 11.43,16.99 10.95,17.46 10.16,17.46 9.21,16.51 6.67,16.51 6.51,16.67 4.92,16.67 4.76,16.51 2.54,16.51 v1.91,15.88
DP  (via drill 0.3)
  Top 0.15: C21.1 R10.1 v13.49,41.12 | IC3.4 7.3,40.48 6.99,40.8 v6.67,40.8
  Route2 0.15: v13.49,41.12 13.18,40.8 v6.67,40.8
DPE
  Top 0.15: CON1.3 16.51,40.48 15.88,41.12 R10.2
DTR
  Top 0.15: R2.1 T1.E 14.46,43.97 11.11,43.97 10.64,44.45 8.89,44.45 8.5,44.06 IC3.28
GND  (via drill 0.3)  (3 unrouted)
  Top 0.15: v6.67,41.59 7.28,40.98 IC3.3 9.5,40.98 IC3.EXP | L3.2 15.32,9.37 v15,9.05 | v18.65,7.14 18.57,6.35 L4.2 | IC6.6 2.43,23.2 C10.2 | IC6.10 3.24,21.2 3.17,21.27 | IC6.5 4.96,24.09 4.92,24.13 | IC6.2 6.46,24.09 6.51,24.13 | IC6.18 5.96,17.71 5.87,17.62 | IC6.16 4.96,17.82 4.92,17.78 | IC6.15 3.46,18.7 3.33,18.57 | IC6.25 8.01,21.2 8.1,21.11
  Top 0.66: v18.89,6.35 18.89,5.64
  Route2 0.15: v6.67,41.59 6.83,41.43 | v15,9.05 16.35,9.05 v18.65,7.14
  other vias: 24.77,46.51 24.77,50.64 24.77,54.61 0.64,61.91 0.64,57.94 0.64,53.98 3.49,57.94 4.6,54.77 4.6,50.96 11.91,51.12 10.64,51.12 18.73,59.37 14.29,60.64 7.14,59.21 7.78,54.77 7.78,43.66 6.03,34.77 16.83,35.88 16.83,35.08 16.83,34.29 19.05,35.08 16.03,35.08 19.05,36.04 15.24,35.08 8.26,23.65 5.08,8.57 7.78,7.14 15.08,37.78 23.34,66.04 23.18,22.54 10.64,20.95 19.21,33.66 19.84,30.16 8.89,28.57 7.78,30.48 10.32,31.59 6.99,55.24 18.26,66.36 7.78,48.42 6.83,44.93 15.56,45.88 4.13,48.26 3.81,43.18 14.76,18.57 7.78,8.41 10.48,7.78 22.86,7.62 1.27,5.71 2.54,5.71 3.81,5.71 5.08,5.71 6.35,5.71 7.62,5.71 8.89,5.71 10.16,5.71 11.43,5.71 12.7,5.71 13.97,5.71 15.24,5.71 20.32,5.71 21.59,5.71 22.86,5.71 24.13,5.71 1.27,70.64 2.54,70.64 3.81,70.64 5.08,70.64 6.35,70.64 7.46,70.64 8.41,70.64 12.7,70.64 13.97,70.64 15.24,70.64 16.51,70.64 17.78,70.64 19.05,70.64 20.32,70.64 21.59,70.64 22.86,70.64 24.61,70.64 8.41,69.61 8.41,67.79 8.41,68.58 10.64,68.58 10.64,69.45 10.64,67.71 10.64,66.67 10.64,65.72 10.64,64.77 10.64,63.9 8.41,65.72 7.14,66.67 8.41,64.77 8.41,63.82 9.21,62.55 12.06,62.55 12.06,61.59 3.81,60.8 3.81,60.01 15.24,54.61 18.73,54.13 17.78,52.39 17.14,48.26 22.07,50.8 18.41,45.24 19.05,43.18 6.83,43.18 3.81,46.99 5.24,32.38 24.13,30.48 16.03,31.59 16.51,29.37 14.61,24.13 11.43,23.34 13.97,22.23 14.29,21.27 2.06,17.3 1.59,25.56 0.79,11.43 5.08,11.43 3.97,63.02 21.75,31.91 21.91,29.21 24.77,17.78 19.37,9.05 17.94,8.57 17.94,7.46 15.72,8.26 15.72,7.3 15.72,6.35 22.86,8.89 7.14,56.99 15.72,10.16
  pour Top: 0,70.96 26.67,70.96 26.67,69.85 25.4,69.85 25.4,5.4 0,5.4
  pour Route2: 0,70.96 25.4,70.96 25.4,69.22 26.67,69.22 26.67,67.94 25.4,67.94 25.4,5.4 0,5.4
  pour Route15: 0,70.96 25.4,70.96 25.4,67.31 26.67,67.31 26.67,66.04 25.4,66.04 25.4,5.4 0,5.4
  cutout Top: 3.65,23.81 7.78,23.81 7.78,18.1 3.65,18.1
GPIO0  (via drill 0.3)
  Top 0.15: IC1.15 20.3,14.59 v20.64,14.92 | IC8.3 9.74,33.87 9.68,34.13 10,34.45 11.59,34.45 v11.91,34.77 | v11.91,34.77 11.93,32.38 | 11.93,32.38 R37.1 | 11.93,32.38 11.91,32.38 v11.91,34.77 | v11.75,26.04 R13.2
  Route15 0.15: v20.64,14.92 20.95,15.24 20.95,17.62 20.48,18.1 16.19,18.1 15.08,19.21 13.02,19.21 12.54,19.68 12.54,25.24 v11.75,26.04 11.91,26.19 v11.91,34.77
GPIO5  (via drill 0.3)
  Top 0.15: IC1.24 15.71,16.2 15.08,16.19 14.61,16.19 13.65,17.14 13.65,18.41 v13.49,18.26 | IC8.1 11.04,31.19 11.11,31.11 | R31.1 11.11,31.11 | 11.11,31.11 10.79,31.11 9.37,29.69 v9.37,29.37
  Route15 0.15: v13.49,18.26 12.22,19.53 12.22,24.29 v11.59,24.92
  Bottom 0.15: v9.37,29.37 9.37,28.89 9.53,28.73 9.53,28.42 9.37,28.26 9.37,27.46 10.95,25.88 10.95,25.56 v11.59,24.92
HOLD  (via drill 0.3)
  Top 0.15: IC1.18 18.71,16.17 19.05,16.51 v19.05,16.83 | IC2.7 v2.54,12.7
  Route15 0.15: v19.05,16.83 19.05,16.51 17.78,15.24 13.34,15.24 13.18,15.4 11.27,15.4 11.11,15.24 7.78,15.24 5.71,13.18 3.81,13.18 3.33,12.7 v2.54,12.7
IC12
  Top 0.15: T3.3 8.8,49.05 IC200.-
MISO1  (via drill 0.3)
  Top 0.15: IC4.2 9.82,55.22 9.21,54.61 v9.21,54.29 | IC1.10 20.46,12.09 v20.64,12.06 | JP3.4 24.13,63.82 23.02,62.71 23.02,61.59 22.7,61.28 21.11,61.28 v20.95,61.12
  Route15 0.15: 9.37,54.29 v9.21,54.29 9.21,54.45 10,55.24 10.64,55.24 10.95,55.56 11.27,55.56 11.59,55.88 12.7,55.88 13.02,55.56 17.14,55.56 20.95,59.37 v20.95,61.12 | v20.64,12.06 20,12.54 20,13.81 20.48,14.29 20.95,14.29 21.27,14.61 21.27,17.78 21.11,17.94 21.11,21.27 13.34,29.05 13.34,34.92 11.91,36.35 11.91,44.13 8.73,47.31 v8.73,50.16
  Bottom 0.15: v9.21,54.29 8.41,53.5 8.41,50.48 v8.73,50.16
MOSI1  (via drill 0.3)
  Top 0.15: IC4.20 7.73,56.78 7.46,56.52 v7.46,56.2 | IC1.12 21.66,13.09 v21.75,13.18 | JP3.3 24.13,61.91 22.86,60.64 21.43,60.64 21.27,60.48 20.8,60.48 20.64,60.64 v19.68,60.64 | v6.03,51.44 5.87,51.28 5.87,50.32 6.83,49.37 6.83,48.42 6.19,47.94 6.19,47.31 6.51,46.99 v10.79,46.99
  Route15 0.15: 7.3,56.36 v7.46,56.2 6.83,56.2 | v19.68,60.64 19.53,60.48 15.24,60.48 14.76,60.01 8.89,60.01 7.3,58.42 7.3,57.94 6.51,57.15 6.51,56.52 6.83,56.2 | v21.75,13.18 21.91,13.34 21.91,18.1 21.75,18.26 21.75,21.59 13.97,29.37 13.97,35.24 12.54,36.67 12.54,44.45 10.79,46.2 v10.79,46.99 | 6.83,56.2 5.71,55.09 5.71,51.75 v6.03,51.44
N$1
  Top 0.15: IC1.27 14.65,14.09 14.29,14.45 12.38,14.45 11.59,13.65 11.59,13.18 11.43,13.02 9.72,13.02 Q1.1 7.84,14.9 C4.1
N$2
  Top 0.15: T2.B R2.2
N$3
  Top 0.15: IC3.6 7.1,39.48 6.51,38.89 6.51,37.78 6.35,37.62 C3.2
N$4
  Top 0.15: IC1.7 18.73,10.79 18.87,10.66 18.87,10.02 19.21,9.68 20.64,9.68 20.95,9.37 22.36,9.37 R5.2
N$5
  Top 0.15: R4.2 T1.B
N$6  (via drill 0.3)
  Top 0.15: IC1.31 14.62,12.09 v14.29,11.75 | v12.7,10.16 R3.1
  Route15 0.15: v14.29,11.75 13.81,11.27 13.81,10.95 13.02,10.16 v12.7,10.16
N$7
  Top 0.15: IC1.8 19.21,10.16 19.37,10 21.72,10 R7.1
N$8
  Top 0.15: R8.1 6.67,15.56 6.51,15.4 6.51,14.45 5.56,13.49 3.97,13.49 3.81,13.65 IC2.6
N$10
  Top 0.15: IC1.2 16.21,10.46 | 16.83,8.41 C14.1 | L3.1
  Top 0.2: 16.21,10.46 16.83,9.84
  Top 0.66: 16.83,9.84 L3.1 16.83,8.41
N$11
  Top 0.15: IC4.10 15.04,58.78 Q2.3 15.72,60.82 C18.2
N$12
  Top 0.15: IC4.8 13.02,57.78 13.65,57.15 13.65,56.99 14.76,55.88 15.74,55.88 C20.2 17.29,57.11 Q2.1
N$13
  Top 0.15: IC4.17 6.19,58.28 R11.2
N$14
  Top 0.15: IC4.5 11.32,55.04 11.91,54.45 C28.2
N$15
  Top 0.15: C5.1 7.75,12.36 8.1,12.7 9.59,12.7 Q1.3 11.91,12.93 11.91,13.49 12.54,14.13 14.13,14.13 14.67,13.59 IC1.28
N$16
  Top 0.15: IC9.5 15.08,34.13 14.92,33.97 14.92,33.34 15.4,32.86 15.9,32.86 R16.2
N$17
  Top 0.15: LD2.2 21.43,35.24 21.27,35.08 19.68,35.08 19.37,34.61 18.89,34.13 IC9.1
N$18
  Top 0.15: IC4.13 10.32,60.8 10,61.12 10,61.56 IC5.3
N$19
  Top 0.15: IC4.12 10.82,60.75 11.27,61.2 11.27,61.56 IC5.4
N$20
  Top 0.15: 9.53,70.51 C32.1 | 9.55,69.37 L1.2
  Top 0.68: ANT1.1 9.53,70.51 | C32.1 9.55,69.37
N$21
  Top 0.15: R25.1 LD2.1
N$22
  Top 0.15: 9.53,66.7 L2.2 | 9.5,65.56 C35.2
  Top 0.68: L1.1 9.53,66.7 | L2.2 9.5,65.56
N$23
  Top 0.15: IC5.1 9.83,63.04 9.53,63.34
  Top 0.68: 9.53,63.34 C35.1
N$24
  Top 0.15: 16.83,5.67 ANT2.ANT
  Top 0.39: 16.8,6.46 16.83,6.43 16.87,6.4 L4.1 16.83,6.19
  Top 0.66: C14.2 16.8,6.46 | 16.83,6.19 16.83,5.67
N$25
  Top 0.15: IC6.11 2.63,20.7 R22.2
N$26
  Top 0.15: IC6.4 5.46,24.67 R23.2
N$27
  Top 0.15: IC6.9 2.47,21.7 C10.1
N$28
  Top 0.15: IC6.27 7.8,22.2 7.94,22.07 8.89,22.07 9.05,22.23 Q3.2 C23.2
N$29  (via drill 0.3)
  Top 0.15: IC11.6 20.49,65.24 20.8,64.93 v22.23,64.93 | IC10.5 19.53,23.5 19.84,23.81 R21.1 20.77,24.79 v20.8,24.77
  Route15 0.15: v22.23,64.93 21.59,64.93 21.27,64.61 21.27,61.75 21.59,61.44 21.59,60.96 21.27,60.64 21.27,51.28 19.84,49.85 19.84,33.81 20.95,32.7 20.95,30.16 19.84,29.05 19.84,26.19 20.8,25.24 v20.8,24.77
  Bottom 0.15: v22.23,64.93 21.91,64.93
N$30
  Top 0.15: IC6.26 8.3,21.7 8.57,21.43 8.57,19.68 Q3.1 C25.2
N$31
  cutout Route2: 3.65,23.81 7.78,23.81 7.78,18.1 3.65,18.1
N$32  (via drill 0.3)
  Top 0.15: T1.C 20.63,46.21 v21.11,45.72 | TAS2.1 TAS2.3 21.97,27.72 v21.75,27.94 | R13.1 v14.92,26.04
  Route2 0.15: v14.92,26.04 21.11,26.04 21.75,26.67 v21.75,27.94
  Route15 0.15: v21.11,45.72 22.07,44.77 22.07,32.54 22.54,32.07 22.54,28.73 v21.75,27.94
N$33
  Top 0.15: IC10.4 20.8,22.23 C34.2
N$34
  Top 0.15: T4.3 8.33,45.72 IC200.+
N$35
  Top 0.15: R12.1 LD3.1
N$36
  Top 0.15: R14.1 LD4.1
N$37  (via drill 0.3)
  Top 0.15: IC3.9 9,37.67 v9.21,37.31 | v12.7,34.77 12.7,33.79 R18.2
  Route2 0.15: v9.68,35.08 10.64,34.13 12.06,34.13 v12.7,34.77
  Route15 0.15: v9.21,37.31 9.37,37.15 9.37,35.4 v9.68,35.08
N$38
  Top 0.15: R15.1 LD5.1
N$39
  Top 0.15: R19.2 20.48,59.05 17.94,61.59 15.72,61.59 13.65,63.66 12.7,63.66 12.06,64.29 12.06,65.18 T5.3
N$40
  Top 0.15: R24.1 14.99,64.23 T5.1 15.05,63.18 T6.3
N$41
  cutout Route15: 3.65,23.81 7.78,23.81 7.78,18.1 3.65,18.1
N$42
  cutout Bottom: 3.65,23.81 7.78,23.81 7.78,18.1 3.65,18.1
N$58
  Top 0.15: IC11.7 19.84,67.82 C7.1
N$59  (via drill 0.3)
  Top 0.15: C6.1 20.8,67.79 v20.48,67.31 | v20.48,62.23 20.48,63.62 IC11.3
  Bottom 0.15: v20.48,67.31 v20.48,62.23
NRST  (via drill 0.3)
  Top 0.15: R1.1 15.88,50.01 17.14,51.28 C13.1 17.14,53.34 18.89,55.09 T2.C 21.92,55.08 22.8,54.19 TAS3.1 TAS3.3 22.86,47.98 v22.86,46.51 | IC1.32 14.92,11.59 14.45,11.11 v14.45,10.95 | R7.2 21.72,11.56 20.95,10.64 20.16,10.64 v20,10.79
  Route15 0.15: v14.45,10.95 15.24,10.95 15.4,11.11 16.67,11.11 16.83,10.95 19.84,10.95 v20,10.79 20.16,10.64 21.43,10.64 22.86,12.06 22.86,13.34 22.54,13.65 22.54,18.41 22.38,18.57 22.38,28.1 22.86,28.57 22.86,32.23 22.38,32.7 22.38,46.04 v22.86,46.51
P0.0  (via drill 0.3)
  Top 0.15: IC8.4 9.09,31.95 8.26,31.11 5.08,31.11 2.54,28.57 v2.54,27.94 | IC6.14 3.5,19.2 3.02,19.68 v1.27,19.68
  Route15 0.15: v1.27,19.68 1.11,19.68 0.64,20.16 0.64,26.04 v2.54,27.94
P0.1  (via drill 0.3)
  Top 0.15: IC8.5 8.44,32.57 v8.41,32.38 | IC4.6 12.75,56.78 13.18,56.36 13.18,56.2 12.22,55.24 v12.06,55.24
  Route15 0.15: v8.41,32.38 8.57,32.54 8.57,34.45 5.71,37.31 5.71,38.73 5.4,39.05 5.4,49.37 7.62,51.59 9.37,51.59 9.84,52.07 9.84,52.86 10.16,53.18 10.16,53.82 10.79,54.45 10.79,54.93 11.11,55.24 v12.06,55.24
P0.2  (via drill 0.3)
  Top 0.15: IC4.3 10.32,54.77 v10.16,54.61 | IC8.6 v7.79,31.92 v7.78,31.91
  Route15 0.15: 10.32,54.45 v10.16,54.61 9.84,54.29 9.84,53.34 9.37,52.86 8.89,52.86 8.57,52.55 8.57,52.07 8.41,51.91 7.46,51.91 5.08,49.53 5.08,38.89 5.4,38.58 5.4,37.15 8.26,34.29 8.26,33.02 7.78,32.54 v7.78,31.91 7.78,32.07
P0.3  (via drill 0.3)
  Top 0.15: IC11.8 19.19,67.2 R30.1 17.49,68.9 v15.56,68.9 | IC8.7 7.14,32.55 v7.14,32.38 | v4.76,61.28 4.76,62.55 v5.24,63.02
  Route15 0.15: v7.14,32.38 7.94,33.18 7.94,34.13 5.08,36.99 5.08,38.42 4.76,38.73 4.76,49.69 5.4,50.32 5.4,55.24 4.45,56.2 4.45,60.96 v4.76,61.28 | v5.24,63.02 5.24,62.87 5.4,62.71 6.19,62.71 7.94,60.96 12.86,60.96 13.02,61.12 13.02,62.39 13.49,62.87 14.29,62.87 15.56,64.14 v15.56,68.9
P0.4  (via drill 0.3)
  Top 0.15: IC8.8 6.49,32.09 v6.51,31.91 | R17.1 12.19,44.95 T4.1 11.02,44.7 10.95,44.77 8.73,44.77 8.26,44.29 4.45,44.29 v4.13,43.97
  Route15 0.15: 6.51,32.38 v6.51,31.91 6.51,32.7 6.83,33.02 7.3,33.02 7.62,33.34 7.62,33.97 4.76,36.83 4.76,38.26 4.45,38.58 4.45,43.66 v4.13,43.97
P0.5  (via drill 0.3)
  Top 0.15: LD5.2 v3.97,64.29 | v3.02,53.98 3.02,53.82 3.17,53.66 3.17,36.51 4.92,34.77 5.24,34.77 5.84,34.17 IC8.9
  Route15 0.15: v3.97,64.29 3.49,64.29 2.86,63.66 2.54,63.66 2.06,63.18 2.06,54.93 v3.02,53.98
  Bottom 0.15: v3.97,64.29 4.13,64.29
P0.6  (via drill 0.3)
  Top 0.15: LD4.2 v2.7,64.29 | v2.22,53.98 2.86,53.34 2.86,36.35 4.76,34.45 4.92,34.45 5.08,34.29 5.19,34.18 IC8.10
  Route15 0.15: v2.7,64.29 2.7,64.14 2.54,64.14 1.75,63.34 1.75,54.45 v2.22,53.98
P0.7  (via drill 0.3)
  Top 0.15: v1.43,53.98 2.54,52.86 2.54,36.2 4.54,34.2 IC8.11 | v17.78,63.18 17.78,62.29 T6.1 | R27.2 16.99,67.15 v17.14,66.99
  Route15 0.15: v1.43,53.98 1.43,63.98 2.38,64.93 4.29,64.93 4.6,64.61 4.6,63.82 4.6,62.71 4.92,62.39 6.03,62.39 7.78,60.64 13.18,60.64 13.34,60.8 13.34,62.23 13.65,62.55 14.29,62.55 15.72,61.12 17.14,61.12 17.78,61.75 v17.78,63.18 17.14,63.82 v17.14,66.99
P1.0  (via drill 0.3)
  Top 0.15: IC8.13 3.89,28.5 v3.81,28.57
  Route15 0.15: v3.81,28.57 3.81,28.89 1.59,31.11 1.27,31.11 JP1.2
  Bottom 0.15: 3.81,28.73 v3.81,28.57
P1.1  (via drill 0.3)
  Top 0.15: IC8.14 4.54,28.17 4.45,28.26 v4.45,29.05
  Route15 0.15: v4.45,29.05 4.45,29.53 4.29,29.69 3.49,29.69 2.54,30.64 2.54,32.07 1.27,33.34 JP1.3
P1.2  (via drill 0.3)
  Top 0.15: IC8.15 5.19,28.47 v5.08,28.57
  Route15 0.15: v5.08,28.57 5.08,29.37 4.45,30 3.65,30 2.86,30.8 2.86,32.23 2.54,32.54 2.54,35.4 JP1.4
P1.3  (via drill 0.3)
  Top 0.15: IC8.16 5.84,28.14 5.71,28.26 v5.71,29.05
  Route15 0.15: v5.71,29.05 5.71,29.21 4.6,30.32 3.81,30.32 3.17,30.96 3.17,32.38 2.86,32.7 2.86,35.56 2.54,35.88 2.54,37.94 1.43,39.21 JP1.5
P1.4  (via drill 0.3)
  Top 0.15: IC8.17 6.49,28.44 v6.35,28.57
  Route15 0.15: v6.35,28.57 6.35,29.21 4.92,30.64 3.97,30.64 3.49,31.11 3.49,32.54 3.17,32.86 3.17,35.72 2.86,36.04 2.86,38.1 2.54,38.42 2.54,40.01 1.27,41.27 JP1.6
P1.5  (via drill 0.3)
  Top 0.15: IC8.18 7.14,28.11 6.99,28.26 v6.99,29.05
  Route15 0.15: v6.99,29.05 6.99,29.21 6.83,29.21 5.08,30.96 4.13,30.96 3.81,31.27 3.81,32.7 3.49,33.02 3.49,35.88 3.17,36.2 3.17,38.26 2.86,38.58 2.86,40.16 2.54,40.48 2.54,42.23 1.27,43.5 JP1.7
P1.6  (via drill 0.3)
  Top 0.15: IC8.19 7.79,28.41 v7.62,28.57
  Route15 0.15: v7.62,28.57 7.62,29.21 7.14,29.69 6.83,29.69 5.24,31.27 4.29,31.27 4.13,31.43 4.13,32.86 3.81,33.18 3.81,36.04 3.49,36.35 3.49,38.42 3.17,38.73 3.17,40.32 2.86,40.64 2.86,42.39 2.54,42.7 2.54,44.77 1.27,46.04 JP1.8
P1.7  (via drill 0.3)
  Top 0.15: IC8.20 8.44,28.08 8.26,28.26 v8.26,29.05
  Route15 0.15: v8.26,29.05 8.26,29.21 8.1,29.21 7.3,30 6.99,30 5.4,31.59 4.45,31.59 4.45,33.02 4.13,33.34 4.13,36.2 3.81,36.51 3.81,38.58 3.49,38.89 3.49,40.48 3.17,40.8 3.17,42.55 2.86,42.86 2.86,44.93 2.54,45.24 2.54,47.31 1.27,48.58 JP1.9
RTS
  Top 0.15: T2.E R4.1 19.84,50.46 19.84,47.47 19.68,47.31 18.26,47.31 14.61,43.66 10.64,43.66 10.5,43.52 IC3.24
RXD  (via drill 0.3)
  Top 0.15: IC1.26 14.62,14.59 13.81,15.4 TP2.PP 12.54,15.72 12.38,15.72 11.59,16.51 11.59,17.94 v11.91,18.26 | IC3.25 v10,43.81
  Route15 0.15: v11.91,18.26 11.75,18.41 10,18.41 9.68,18.73 9.68,21.59 10.48,22.38 10.48,25.72 10.79,26.04 10.79,26.51 11.27,26.99 11.27,33.97 10.95,34.29 10.95,35.08 11.27,35.4 11.27,43.66 11.11,43.81 v10,43.81
SCK1  (via drill 0.3)
  Top 0.15: IC4.1 9.32,55.2 8.89,54.77 v8.57,54.77 | IC1.9 20.32,11.59 v20.64,11.27 | JP3.2 23.65,60.17 20.48,60.17 v20.32,60.01
  Route15 0.15: 8.73,54.77 v8.57,54.77 8.57,56.2 7.78,56.99 7.78,57.31 7.62,57.47 7.62,58.26 9.05,59.69 15.08,59.69 15.4,60.01 v20.32,60.01 | v20.64,11.27 21.59,11.27 22.54,12.22 22.54,13.18 22.23,13.49 22.23,18.26 22.07,18.41 22.07,21.75 14.29,29.53 14.29,35.4 12.86,36.83 12.86,44.61 11.43,46.04 11.43,47.47 9.84,49.05 v9.84,50.16
  Bottom 0.15: v8.57,54.77 8.57,54.13 8.1,53.66 8.1,50.01 8.57,49.53 9.21,49.53 v9.84,50.16
SCLK  (via drill 0.3)
  Top 0.15: R39.1 10.79,29.84 | 10.79,29.84 10.64,29.84 9.74,28.95 IC8.22 9.74,26.56 v9.21,26.04 | IC6.19 6.46,17.82 6.51,17.78 v7.14,17.78 | v14.29,17.46 16.67,17.46 16.99,17.78 18.41,17.78 18.73,17.46 19.21,17.46 19.53,17.14 19.68,17.14 20.32,16.51 20.32,15.56 | IC1.16 20,15.09 20,15.08 20.32,15.4 20.32,15.56 | JP2.2 23.65,16.35 22.54,15.24 21.11,15.24 20.8,15.56 20.32,15.56 | IC7.4 21.14,30.93 21.43,30.64 21.75,30.64 v21.91,30.8 | v10.48,30 10.79,29.84 | v6.83,47.62 7.14,47.62 7.62,47.31 10.32,47.31 10.95,47.94 11.85,47.94 T3.1
  Route2 0.15: v21.91,30.8 21.43,31.27 17.46,31.27 16.99,30.8 11.27,30.8 v10.48,30
  Route15 0.15: 7.62,17.78 11.11,17.78 11.59,17.3 14.13,17.3 v14.29,17.46 | v9.21,26.04 9.84,25.4 9.84,22.7 9.05,21.91 9.05,19.05 8.1,19.05 7.62,18.57 7.62,17.78 | 7.62,17.78 v7.14,17.78 | v10.48,30 10,30 9.21,30.8 9.21,31.75 9.37,31.91 9.37,33.02 9.21,33.18 9.21,34.77 6.35,37.62 6.35,39.05 6.03,39.37 6.03,46.83 v6.83,47.62
SDI  (via drill 0.3)
  Top 0.15: R38.1 10.79,28.57 | 10.79,28.57 10.39,28.17 IC8.23 10.39,26.26 10.16,26.04 v10,26.04 | IC6.20 7.96,18.7 v8.26,18.41 | v20.32,17.3 20.48,17.3 22.23,19.05 JP2.3 23.02,19.05 | IC1.14 20.28,14.09 20.48,14.29 20.8,14.29 21.43,14.92 23.02,14.92 v23.34,15.24 | LD3.2 1.43,64.29 2.7,63.02 v2.86,63.02 | v4.13,49.21 v6.03,49.21 | v10.64,28.89 10.48,28.89 10.79,28.57 | IC7.3 20.49,30.47 20.8,30.16 21.75,30.16 v21.91,30
  Route2 0.15: v21.91,30 20.95,30.96 17.62,30.96 17.14,30.48 11.91,30.48 10.64,29.21 v10.64,28.89
  Route15 0.15: v20.32,17.3 19.68,17.78 15.24,17.78 15.08,17.94 14.61,17.94 14.45,18.1 14.13,18.1 13.65,17.62 11.75,17.62 11.27,18.1 9.37,18.1 | v10,26.04 10.16,25.88 10.16,22.54 9.37,21.75 9.37,18.1 | 9.37,18.1 8.57,18.1 v8.26,18.41 | v23.34,15.24 22.86,15.72 22.86,17.78 JP2.3 | v2.86,63.02 2.38,62.55 2.38,55.56 3.97,53.98 3.97,49.37 v4.13,49.21 | v6.03,49.21 5.71,48.9 5.71,39.21 6.03,38.89 6.03,37.47 8.89,34.61 8.89,33.02 9.05,32.86 9.05,32.07 8.89,31.91 8.89,30.64 v10.64,28.89
SS1  (via drill 0.3)
  Top 0.15: R6.2 23.81,12.06 22.2,13.68 22.04,13.81 20.8,13.81 v20.64,13.65 20.57,13.59 IC1.13 | IC4.7 12.72,57.28 14.13,55.88 14.13,49.21 13.97,49.05 11.27,49.05 10.32,48.1 v9.37,48.1
  Route15 0.15: v20.64,13.65 20.8,13.65 21.59,14.29 21.59,17.94 21.43,18.1 21.43,21.43 13.65,29.21 13.65,35.08 12.22,36.51 12.22,44.29 9.37,47.15 v9.37,48.1
TOUT  (via drill 0.3)
  Top 0.15: R19.1 R20.1 21.25,56.04 19.21,56.04 18.73,55.56 18.73,55.4 16.19,52.86 15.4,52.86 15.08,52.55 15.08,47.47 v16.03,46.51 | IC1.6 18.21,10.36 v18.34,10.24 | v11.75,14.61 11.43,14.92 11.43,16.03 11.27,16.19 11.27,18.41 11.75,18.89 14.29,18.89 14.76,19.37 v14.76,20.48 | v16.03,25.4 16.35,25.4 17.46,26.51 17.46,27.62 v17.14,27.94
  Route15 0.15: v18.34,10.24 17.94,10.64 16.67,10.64 16.51,10.79 15.56,10.79 15.4,10.64 15.08,10.64 14.76,10.32 13.65,10.32 12.86,9.53 12.38,9.53 12.06,9.84 12.06,12.38 11.75,12.7 v11.75,14.61 | v14.76,20.48 15.72,21.43 15.72,25.08 v16.03,25.4 | v17.14,27.94 17.3,28.1 17.3,30.8 17.62,31.11 17.62,36.35 16.99,36.99 v16.99,45.24
  Bottom 0.15: v16.99,45.24 16.99,45.56 v16.03,46.51
TXD  (via drill 0.3)
  Top 0.15: IC1.25 14.6,15.09 12.54,16.99 TP1.PP 12.54,18.1 v12.7,18.26 | IC3.26 9.5,43.52 v9.21,43.81
  Route15 0.15: v12.7,18.26 12.06,18.89 11.75,18.89 11.59,18.73 10.16,18.73 10,18.89 10,21.43 10.79,22.23 10.79,25.56 11.11,25.88 11.11,26.35 11.59,26.83 11.59,34.13 11.27,34.45 11.27,34.92 11.59,35.24 11.59,43.97 11.11,44.45 9.84,44.45 v9.21,43.81
V-BAT  (via drill 0.3)
  Top 0.15: IC11.1 19.19,64.32 18.57,64.93 18.1,64.93 15.14,67.88 BAT1.+ 13.02,67.25 T5.2 14.99,66.26 R24.2 | R21.2 20.19,26.33 24.13,22.38 JP2.4 | 18.1,36.09 IC9.3
  Top 0.406: 18.57,18.41 19.21,18.1 20.64,18.1 JP2.4
  Top 0.61: 18.57,18.41 IC10.1 15.72,18.41 | v18.1,38.42 v18.1,36.83 | v18.1,36.83 v18.1,37.62 | v18.1,36.83 18.1,36.09
  Top 0.813: v18.1,27.78 v18.1,30.16 18.1,26.19 16.51,24.61 16.51,21.59 15.72,20.95 15.72,18.41
  Bottom 0.813: BAT1.+ 13.02,46.04 18.1,40.96 v18.1,38.42 v18.1,37.62 v18.1,36.83 v18.1,30.16 v18.1,29.37 v18.1,28.57 v18.1,27.78
VBUS  (1 unrouted)
  Top 0.15: IC9.4 14.13,36.03 13.97,36.2 | R25.2 20.03,35.85 | 8.5,36.27 C1.2 | IC3.7 7.23,38.98 | 6.99,36.35 C2.2 | IC3.8 8.5,37.87 | 8.5,36.11 8.57,36.04
  Top 0.305: C16.1 IC9.4 | 13.97,37.31 14.61,37.31 14.92,36.99 16.03,36.99 16.99,37.94 16.99,38.58 17.59,39.18 CON1.1 19.68,39.18 19.68,36.33 R25.2 | 13.97,37.31 10.16,37.31 9.68,36.83 9.68,36.2 9.53,36.04 C1.2 | IC3.8 8.5,36.27 | 7.23,38.98 6.99,38.73 6.99,36.35 | 8.57,36.04 C2.2 | 13.97,36.2 13.97,37.31
WP  (via drill 0.3)
  Top 0.15: IC1.19 18.21,16.15 18.41,16.35 18.41,16.83 18.26,16.99 v18.26,17.14 | IC2.3 3.81,9.84 3.17,10.48 v3.17,13.34
  Route15 0.15: v18.26,17.14 18.26,16.99 18.41,16.83 18.41,16.35 17.62,15.56 13.49,15.56 13.34,15.72 11.11,15.72 10.95,15.56 7.62,15.56 5.56,13.49 3.33,13.49 v3.17,13.34

### Text on the board
tStop: LIOT | ESP8266 | FX42